# Altium project Chronos.PrjPcb (part 3 of 3)

## Sheet 08- Bank2_6_7.SchDoc: Bank 2-6-7
size A3; Page Number: 6; Page Size: B; Page Count: 14; Board Rev: B; Project Name: CrossLink-NX Evaluation Board; RevCode: 1.0; Doc: 305-PD-19-0819; DsnPath: C:\Users\HAltinkilit\Downloads\Crosslink-NX-Design-Files\CrossLink-NX-Eval-Brd-Schematic-RevB-191122.DSN; SchematicName: SCHEMATIC1; PageName: 06 - Serdes SMAs And Switches; PageSize: B; TopSchematic: True
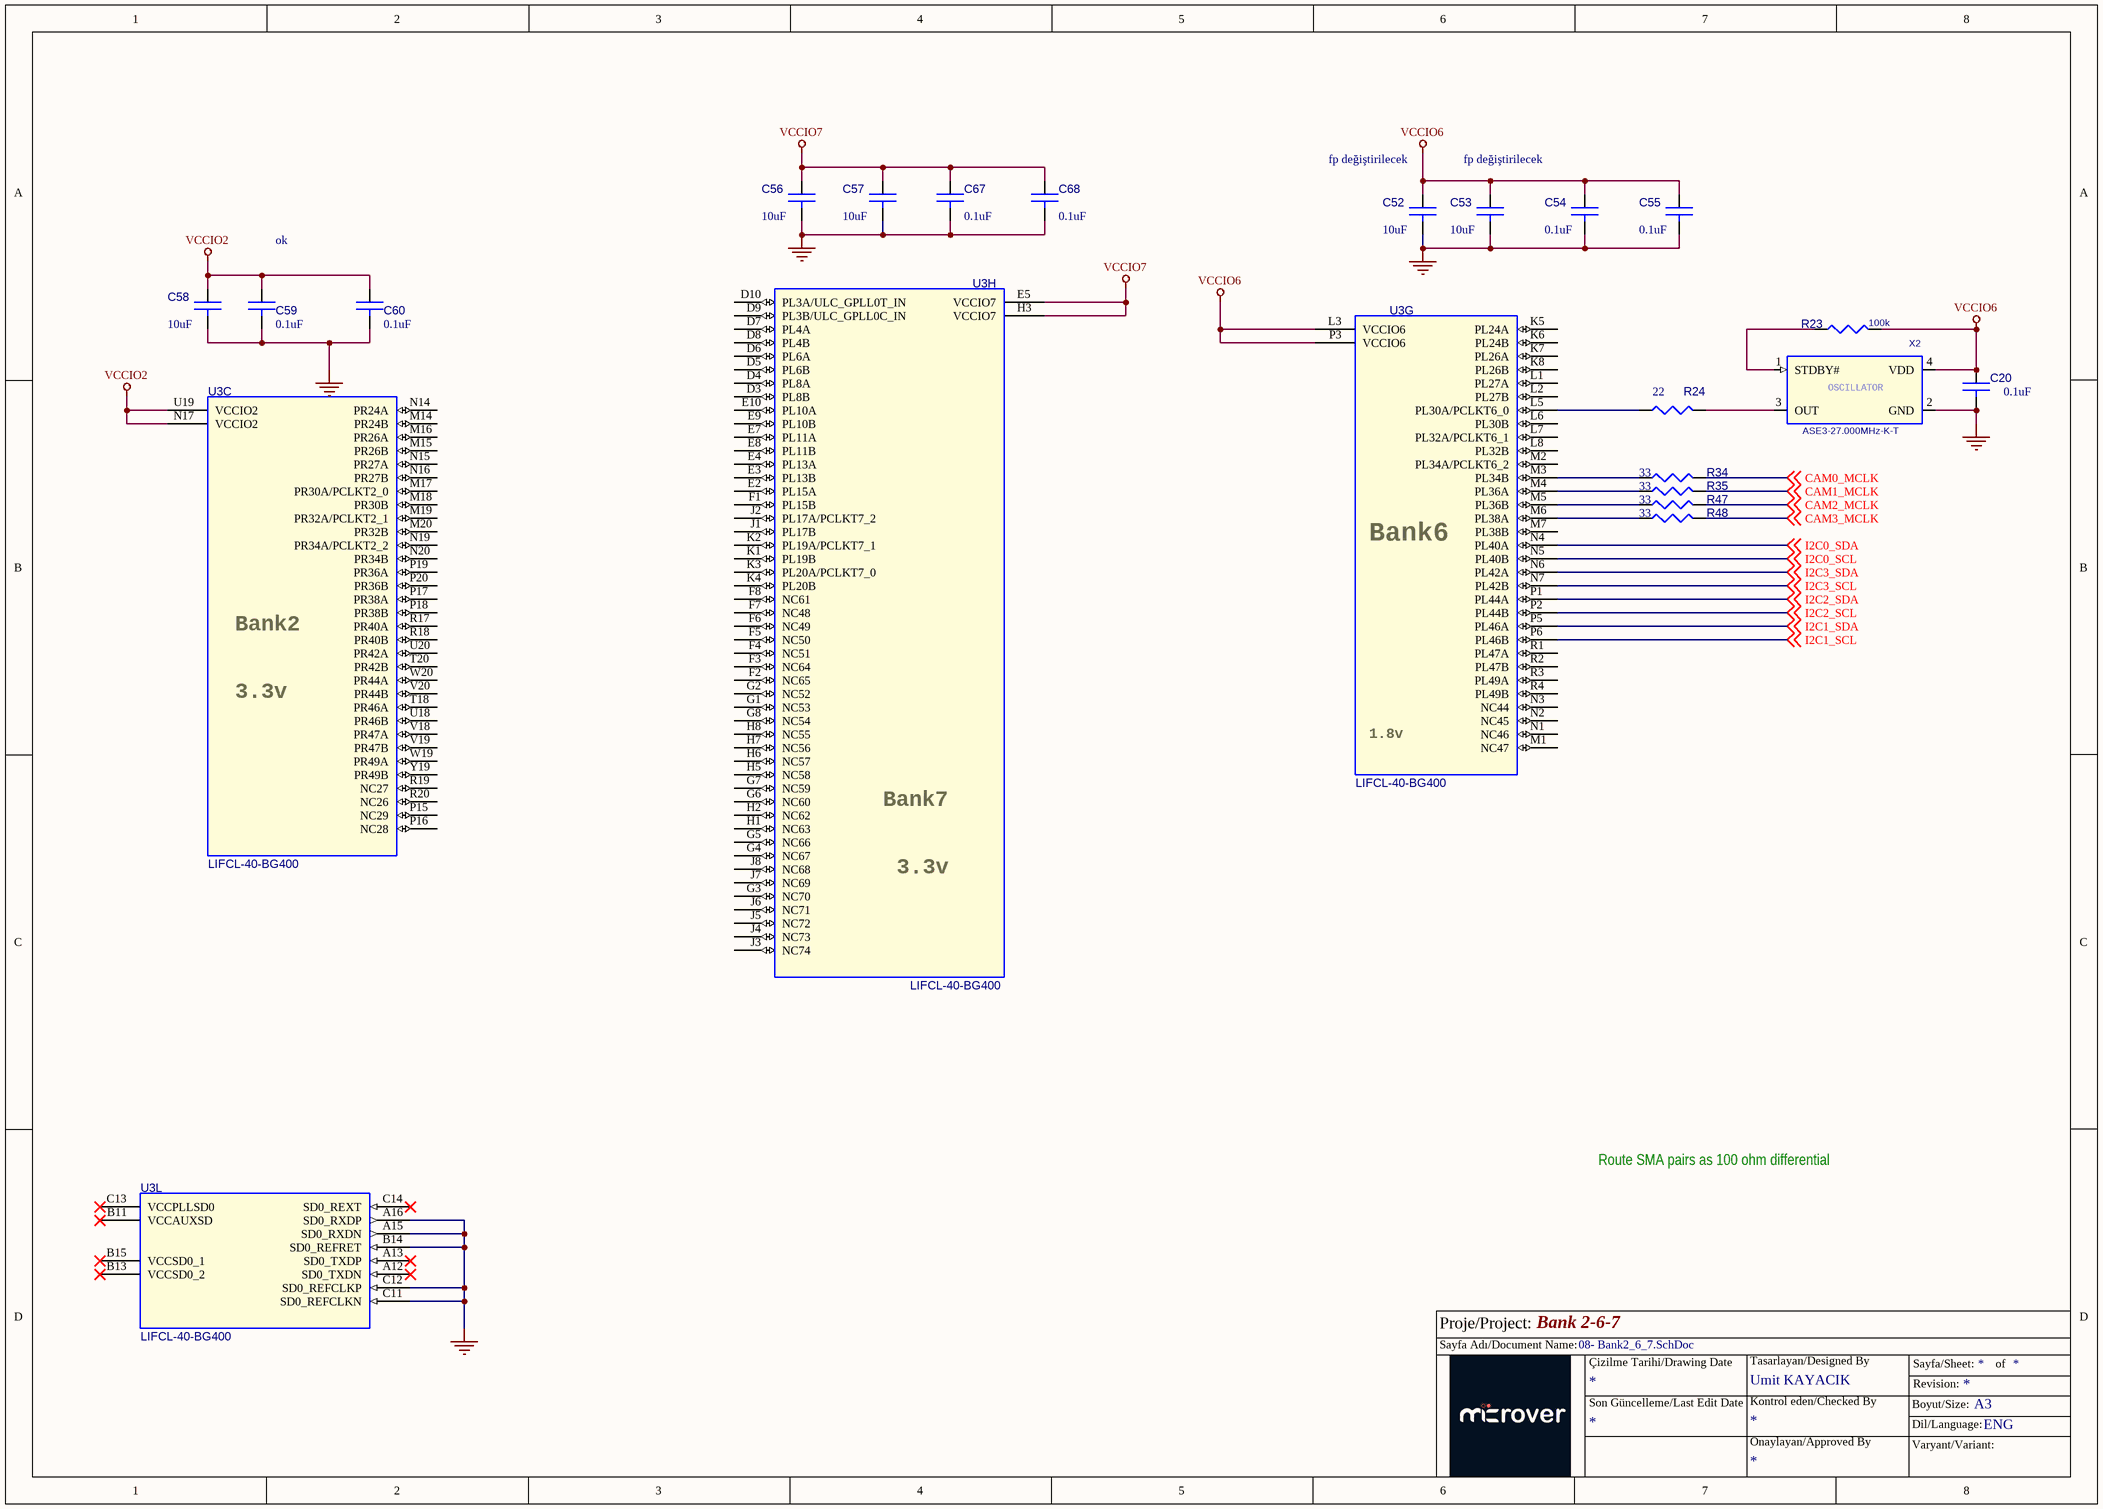
[diagram p7: 08- Bank2_6_7.SchDoc]

### Parts
C20  0.1uF  [C0201]
C52  10uF  [C0603]
C53  10uF  [C0603]
C54  0.1uF  [C0201]
C55  0.1uF  [C0201]
C56  10uF  [C0603]
C57  10uF  [C0603]
C58  10uF  [C0603]
C59  0.1uF  [C0201]
C60  0.1uF  [C0201]
C67  0.1uF  [C0201]
C68  0.1uF  [C0201]
R23  100k  [R0402]
R24  22  [R0402]
R34  33  [R0201]
R35  33  [R0201]
R47  33  [R0201]
R48  33  [R0201]
U3  LIFCL-40-BG400  [LIFCL-40-BG400]  (parts C,G,H,L of 15)
X2  ASE3-27.000MHz-K-T  [27MHZ]

### Nets
GND: C20.2 C52.2 C53.2 C54.2 C55.2 C56.2 C57.2 C58.2 C59.2 C60.2 C67.2 C68.2 U3.A15(SD0_RXDN) U3.A16(SD0_RXDP) U3.B14(SD0_REFRET) U3.C11(SD0_REFCLKN) U3.C12(SD0_REFCLKP) X2.2(GND)
VCCIO2: C58.1 C59.1 C60.1 U3.N17(VCCIO2) U3.U19(VCCIO2)
VCCIO6: C20.1 C52.1 C53.1 C54.1 C55.1 R23.2 U3.L3(VCCIO6) U3.P3(VCCIO6) X2.4(VDD)
VCCIO7: C56.1 C57.1 C67.1 C68.1 U3.E5(VCCIO7) U3.H3(VCCIO7)
CAM0_MCLK: R34.2 ; off-sheet CAM0_MCLK
CAM1_MCLK: R35.2 ; off-sheet CAM1_MCLK
CAM2_MCLK: R47.2 ; off-sheet CAM2_MCLK
CAM3_MCLK: R48.2 ; off-sheet CAM3_MCLK
I2C0_SCL: U3.N5(PL40B) ; off-sheet I2C0_SCL  [project net CAM0_SCL]
I2C0_SDA: U3.N4(PL40A) ; off-sheet I2C0_SDA  [project net CAM0_SDA]
I2C1_SCL: U3.P6(PL46B) ; off-sheet I2C1_SCL  [project net CAM1_SCL]
I2C1_SDA: U3.P5(PL46A) ; off-sheet I2C1_SDA  [project net CAM1_SDA]
I2C2_SCL: U3.P2(PL44B) ; off-sheet I2C2_SCL  [project net CAM2_SCL]
I2C2_SDA: U3.P1(PL44A) ; off-sheet I2C2_SDA  [project net CAM2_SDA]
I2C3_SCL: U3.N7(PL42B) ; off-sheet I2C3_SCL  [project net CAM3_SCL]
I2C3_SDA: U3.N6(PL42A) ; off-sheet I2C3_SDA  [project net CAM3_SDA]
NetR23_1: R23.1 X2.1(STDBY#)
NetR24_1: R24.1 X2.3(OUT)
NetR24_2: R24.2 U3.L5(PL30A/PCLKT6_0)
NetR34_1: R34.1 U3.M3(PL34B)
NetR35_1: R35.1 U3.M4(PL36A)
NetR47_1: R47.1 U3.M5(PL36B)
NetR48_1: R48.1 U3.M6(PL38A)

Not connected (* = marked no-connect by the designer): U3 A12(SD0_TXDN)* A13(SD0_TXDP)* B11(VCCAUXSD)* B13(VCCSD0_2)* B15(VCCSD0_1)* C13(VCCPLLSD0)* C14(SD0_REXT)* D3(PL8B) D4(PL8A) D5(PL6B) D6(PL6A) D7(PL4A) D8(PL4B) D9(PL3B/ULC_GPLL0C_IN) D10(PL3A/ULC_GPLL0T_IN) E2(PL15A) E3(PL13B) E4(PL13A) E7(PL11A) E8(PL11B) E9(PL10B) E10(PL10A) F1(PL15B) F2(NC65) F3(NC64) F4(NC51) F5(NC50) F6(NC49) F7(NC48) F8(NC61) G1(NC53) G2(NC52) G3(NC70) G4(NC67) G5(NC66) G6(NC60) G7(NC59) G8(NC54) H1(NC63) H2(NC62) H5(NC58) H6(NC57) H7(NC56) H8(NC55) J1(PL17B) J2(PL17A/PCLKT7_2) J3(NC74) J4(NC73) J5(NC72) J6(NC71) J7(NC69) J8(NC68) K1(PL19B) K2(PL19A/PCLKT7_1) K3(PL20A/PCLKT7_0) K4(PL20B) K5(PL24A) K6(PL24B) K7(PL26A) K8(PL26B) L1(PL27A) L2(PL27B) L6(PL30B) L7(PL32A/PCLKT6_1) L8(PL32B) M1(NC47) M2(PL34A/PCLKT6_2) M7(PL38B) M14(PR24B) M15(PR26B) M16(PR26A) M17(PR30A/PCLKT2_0) M18(PR30B) M19(PR32A/PCLKT2_1) M20(PR32B) N1(NC46) N2(NC45) N3(NC44) N14(PR24A) N15(PR27A) N16(PR27B) N19(PR34A/PCLKT2_2) N20(PR34B) P15(NC29) P16(NC28) P17(PR38A) P18(PR38B) P19(PR36A) P20(PR36B) R1(PL47A) R2(PL47B) R3(PL49A) R4(PL49B) R17(PR40A) R18(PR40B) R19(NC27) R20(NC26) T18(PR46A) T20(PR42B) U18(PR46B) U20(PR42A) V18(PR47A) V19(PR47B) V20(PR44B) W19(PR49A) W20(PR44A) Y19(PR49B)

### Notes on the sheet
- (near C52) fp değiştirilecek
- fp değiştirilecek
- ok
- (near X2) OSCILLATOR
- (near U3) Bank6
- (near U3) Bank2
- (near U3) 3.3v
- (near U3) 1.8v
- (near U3) Bank7
- Route SMA pairs as 100 ohm differential
- Proje/Project:
- Sayfa Adı/Document Name:
- Çizilme Tarihi/Drawing Date
- Umit KAYACIK
- Tasarlayan/Designed By
- Sayfa/Sheet:
- Revision:
- of
- Son Güncelleme/Last Edit Date
- Kontrol eden/Checked By
- Onaylayan/Approved By
- Boyut/Size:
- Varyant/Variant:
- Dil/Language:
- A3
- ENG

### Library data of the parts
C20 = 0u1_0402: CAP CER 0.1UF 25V 10% X5R 0201; Manufacturer: Murata; Manufacturer Part Number: GRM033R61E104KE14J; Part Reference: C20; Class: Discrete; Digikey P/N: 399-3521-2-ND; Assy: -; Value: 0.1uF; PCB Footprint: C0201
C52 = 10uF_0603: CAP CECAP CER 10UF 10V X5R 20% 0603; Manufacturer: Taiyo Yuden; Manufacturer Part Number: LMK107BJ106MALTD; Part Reference: C39; Class: Discrete; Digikey P/N: 587-2562-1-ND; Assy: -; Value: 10uF; PCB Footprint: C0603
C53 = 0u1_0402: CAP CECAP CER 10UF 10V X5R 20% 0603; Manufacturer: Taiyo Yuden; Manufacturer Part Number: LMK107BJ106MALTD; Part Reference: C40; Class: Discrete; Digikey P/N: 399-3521-2-ND; Assy: -; Value: 10uF; PCB Footprint: C0603
C54 = 0u1_0402: CAP CER 0.1UF 25V 10% X5R 0201; Manufacturer: Murata; Manufacturer Part Number: GRM033R61E104KE14J; Part Reference: C41; Class: Discrete; Digikey P/N: 399-3521-2-ND; Assy: -; Value: 0.1uF; PCB Footprint: C0201
C55 = 0u1_0402: CAP CER 0.1UF 25V 10% X5R 0201; Manufacturer: Murata; Manufacturer Part Number: GRM033R61E104KE14J; Part Reference: C42; Class: Discrete; Digikey P/N: 399-3521-2-ND; Assy: -; Value: 0.1uF; PCB Footprint: C0201
C56 = 10uF_0603: CAP CECAP CER 10UF 10V X5R 20% 0603; Manufacturer: Taiyo Yuden; Manufacturer Part Number: LMK107BJ106MALTD; Part Reference: C68; Class: Discrete; Digikey P/N: 587-2562-1-ND; Assy: -; Value: 10uF; PCB Footprint: C0603
C57 = 10uF_0603: CAP CECAP CER 10UF 10V X5R 20% 0603; Manufacturer: Taiyo Yuden; Manufacturer Part Number: LMK107BJ106MALTD; Part Reference: C69; Class: Discrete; Digikey P/N: 587-2562-1-ND; Assy: -; Value: 10uF; PCB Footprint: C0603
C58 = 10uF_0603: CAP CECAP CER 10UF 10V X5R 20% 0603; Manufacturer: Taiyo Yuden; Manufacturer Part Number: LMK107BJ106MALTD; Part Reference: C58; Class: Discrete; Digikey P/N: 587-2562-1-ND; Assy: -; Value: 10uF; PCB Footprint: C0603
C59 = 0u1_0402: CAP CER 0.1UF 25V 10% X5R 0201; Manufacturer: Murata; Manufacturer Part Number: GRM033R61E104KE14J; Part Reference: C59; Class: Discrete; Digikey P/N: 399-3521-2-ND; Assy: -; Value: 0.1uF; PCB Footprint: C0201
C60 = 0u1_0402: CAP CER 0.1UF 25V 10% X5R 0201; Manufacturer: Murata; Manufacturer Part Number: GRM033R61E104KE14J; Part Reference: C60; Class: Discrete; Digikey P/N: 399-3521-2-ND; Assy: -; Value: 0.1uF; PCB Footprint: C0201
C67 = 0u1_0402: CAP CER 0.1UF 25V 10% X5R 0201; Manufacturer: Murata; Manufacturer Part Number: GRM033R61E104KE14J; Part Reference: C70; Class: Discrete; Digikey P/N: 399-3521-2-ND; Assy: -; Value: 0.1uF; PCB Footprint: C0201
C68 = 0u1_0402: CAP CER 0.1UF 25V 10% X5R 0201; Manufacturer: Murata; Manufacturer Part Number: GRM033R61E104KE14J; Part Reference: C71; Class: Discrete; Digikey P/N: 399-3521-2-ND; Assy: -; Value: 0.1uF; PCB Footprint: C0201
R23 = RES_100K_1W16_0402_5P: RES 100K OHM 1/10W 1% 0402 SMD; Part Reference: R23; Unit Price (USD): 0.02; Total Area(sq-mm): 0.5; Wattage: 1/16W; DIST: FLAT; MAX_TEMP: RTMAX; MFG P/N: ERJ-2RKF1003X; MFG: Panasonic; TC1: 0; Length(mm): 1; Width(mm): 0.5; TC2: 0; Value: 100k; Manufacturer Part Number: ERJ-2RKF1003X; Manufacturer: Panasonic; PART_NUMBER: ERJ-2RKF1003X; Assy: -; PCB Footprint: R0402
R24 = 0R_0603: RES SMD 22 OHM 1% 1/10W 0402; Manufacturer: Panasonic; Manufacturer Part Number: ERJ-2RKF22R0X; Part Reference: R24; Class: Discrete; Digikey P/N: 311-0.0GRTR-ND; Assy: -; Value: 22; MFG P/N: ERJ-2RKF22R0X; MFG: Panasonic; PCB Footprint: R0402
R34 R35 R47 R48 = 0R_0603: RES SMD 33 OHM 1% 1/10W; Manufacturer: Panasonic; Manufacturer Part Number: ERJ-2RKF33R0X; Part Reference: R5; Class: Discrete; PCB Footprint: R0402; Digikey P/N: 311-0.0GRTR-ND; Assy: -; Value: 33
U3 = LIFCL-40-BG400: Part Reference: U3; Source Part: LIFCL-40-BG400A.Normal; SWAP_INFO: (S1+S2+S3+S4+S5+S6+S7+S8+S9+S10+S11+S12+S13+S14+S15); SPLIT_INST: TRUE; Name: I17266603; Primitive: DEFAULT; Implementation Type: <none>; Location X-Coordinate: 0; Source Library: C:\USERS\SLIU1\DOCUMENTS\PCB_DESIGN\JEDI_EVAL_BOARD\SCHEMATIC\LIFCL40.OLB; Power Pins Visible: False; Value: LIFCL-40-BG400; Assy: -; Location Y-Coordinate: 0; Color: Default; Source Package: LIFCL-40-BG400; Graphic: LIFCL-40-BG400A.Normal; PCB Footprint: LIFCL-40-BG400
X2 = OSC_25MHz_10PPM: Standard Clock Oscillators 27.000M 1.8V 30ppm; Part Reference: X2; Manufacturer: ABRACON; MFG: Abracon Corporation; Total Area(sq-mm): 16.83; MFG P/N: ASFLMB-25.000MHZ-LY-T; Unit Price (USD): 1.96; Length(mm: 5.1; Width(mm): 3.3; Value: ASE3-27.000MHz-K-T; Assy: -; Manufacturer Part Number: ASE3-27.000MHz-K-T; PCB Footprint: 27MHZ

## Sheet 09- I2C, LEDs And Push Button.SchDoc: I2C LEDs And Push Buttons
size A3; Page Number: 7; Page Size: B; Page Count: 14; Board Rev: B; Project Name: CrossLink-NX Evaluation Board; RevCode: 1.0; Doc: 305-PD-19-0819; DsnPath: C:\Users\HAltinkilit\Downloads\Crosslink-NX-Design-Files\CrossLink-NX-Eval-Brd-Schematic-RevB-191122.DSN; SchematicName: SCHEMATIC1; PageName: 07 - I2C, LEDs And Push Button; PageSize: B; TopSchematic: True
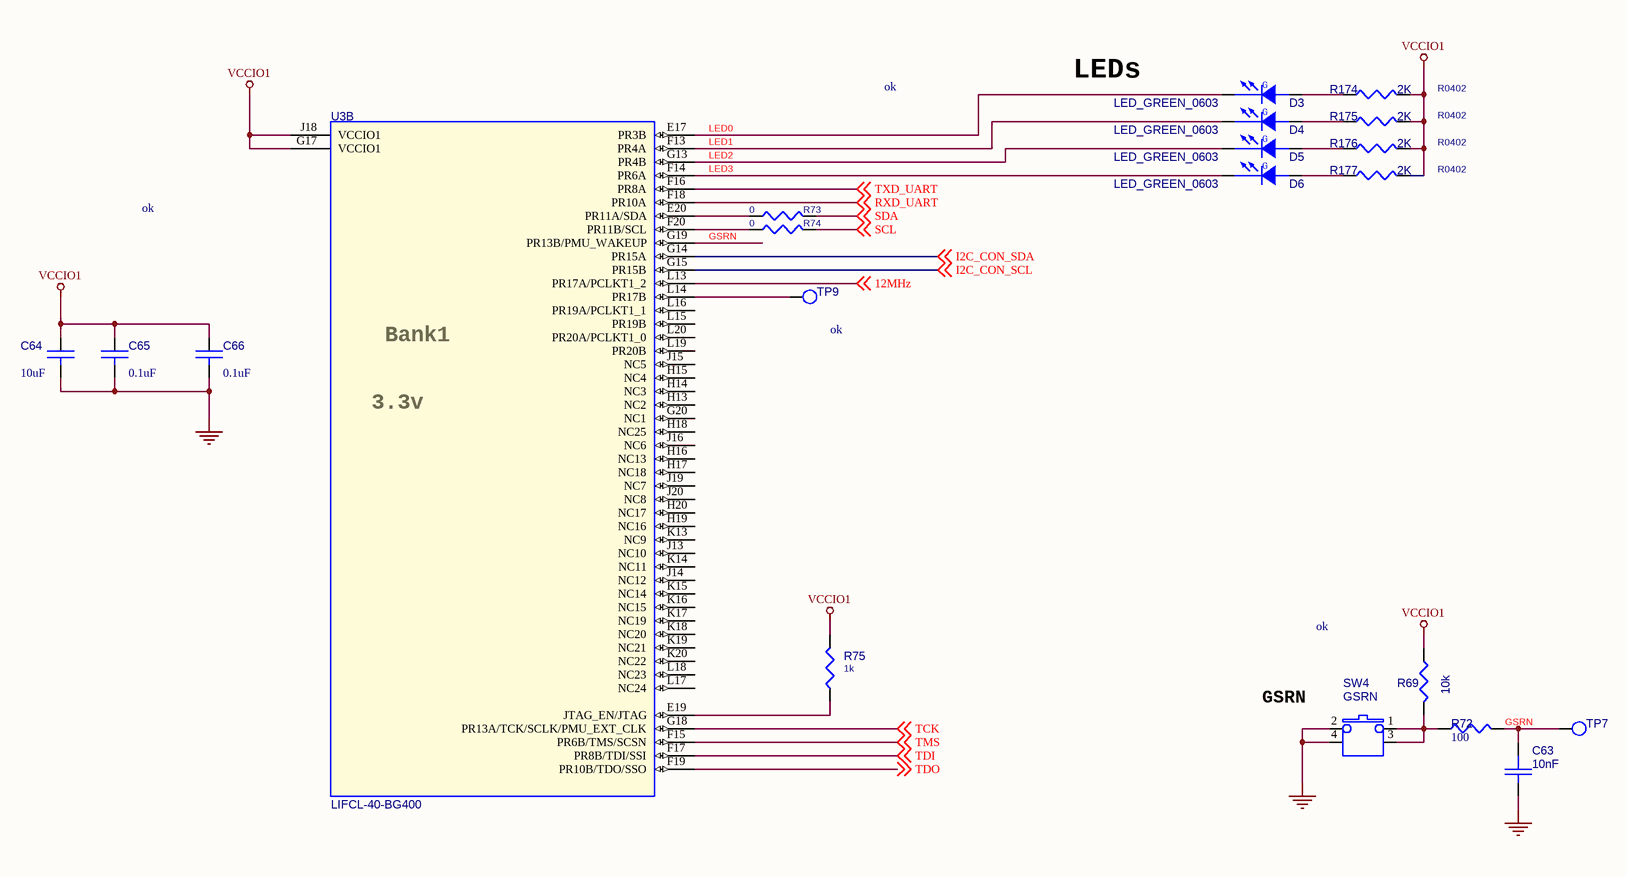
[diagram p8: 09- I2C, LEDs And Push Button.SchDoc]

### Parts
C63  10nF  [RLP-130-A]
C64  10uF  [C0603]
C65  0.1uF  [C0201]
C66  0.1uF  [C0201]
D3  LED_GREEN_0603  [APT1608]
D4  LED_GREEN_0603  [APT1608]
D5  LED_GREEN_0603  [APT1608]
D6  LED_GREEN_0603  [APT1608]
R69  10k  [R0402]
R72  100  [R0402]
R73  0  [R0402]
R74  0  [R0402]
R75  1k  [R0402]
R174  2K  [R0402]
R175  2K  [R0402]
R176  2K  [R0402]
R177  2K  [R0402]
SW4  GSRN  [4psmd_switch]
TP7  TestPoint  [TP_1MM]  (value not drawn)
TP9  TestPoint  [TP_1MM]  (value not drawn)
U3  LIFCL-40-BG400  [LIFCL-40-BG400]  (part B of 15)

### Nets
GND: C63.2 C64.2 C65.2 C66.2 SW4.2 SW4.4
VCCIO1: C64.1 C65.1 C66.1 R69.1 R75.2 R174.2 R175.2 R176.2 R177.2 U3.G17(VCCIO1) U3.J18(VCCIO1)
12MHz: U3.L13(PR17A/PCLKT1_2) ; off-sheet 12MHz
GSRN: C63.1 R72.2 TP7.1(TP) U3.G19(PR13B/PMU_WAKEUP)
I2C_CON_SCL: U3.G15(PR15B) ; off-sheet I2C_CON_SCL
I2C_CON_SDA: U3.G14(PR15A) ; off-sheet I2C_CON_SDA
LED0: D3.1(CATHODE) U3.E17(PR3B)
LED1: D4.1(CATHODE) U3.F13(PR4A)
LED2: D5.1(CATHODE) U3.G13(PR4B)
LED3: D6.1(CATHODE) U3.F14(PR6A)
RXD_UART: U3.F18(PR10A) ; off-sheet RXD_UART
SCL: R74.1 ; off-sheet SCL
SDA: R73.1 ; off-sheet SDA
TCK: U3.G18(PR13A/TCK/SCLK/PMU_EXT_CLK) ; off-sheet TCK
TDI: U3.F17(PR8B/TDI/SSI) ; off-sheet TDI
TDO: U3.F19(PR10B/TDO/SSO) ; off-sheet TDO
TMS: U3.F15(PR6B/TMS/SCSN) ; off-sheet TMS
TXD_UART: U3.F16(PR8A) ; off-sheet TXD_UART
NetD3_2: D3.2(ANODE) R174.1
NetD4_2: D4.2(ANODE) R175.1
NetD5_2: D5.2(ANODE) R176.1
NetD6_2: D6.2(ANODE) R177.1
NetR69_2: R69.2 R72.1 SW4.1 SW4.3
NetR73_2: R73.2 U3.E20(PR11A/SDA)
NetR74_2: R74.2 U3.F20(PR11B/SCL)
NetR75_1: R75.1 U3.E19(JTAG_EN/JTAG)
NetTP9_1: TP9.1(TP) U3.L14(PR17B)

Not connected (* = marked no-connect by the designer): U3 G20(NC1) H13(NC2) H14(NC3) H15(NC4) H16(NC13) H17(NC18) H18(NC25) H19(NC16) H20(NC17) J13(NC10) J14(NC12) J15(NC5) J16(NC6) J19(NC7) J20(NC8) K13(NC9) K14(NC11) K15(NC14) K16(NC15) K17(NC19) K18(NC20) K19(NC21) K20(NC22) L15(PR19B) L16(PR19A/PCLKT1_1) L17(NC24) L18(NC23) L19(PR20B) L20(PR20A/PCLKT1_0)

### Notes on the sheet
- LEDs
- ok
- (near U3) Bank1
- (near TP9) ok
- (near U3) 3.3v
- (near SW4) GSRN
- Proje/Project:
- Sayfa Adı/Document Name:
- Çizilme Tarihi/Drawing Date
- Umit KAYACIK
- Tasarlayan/Designed By
- Sayfa/Sheet:
- Revision:
- of
- Son Güncelleme/Last Edit Date
- Kontrol eden/Checked By
- Onaylayan/Approved By
- Boyut/Size:
- Varyant/Variant:
- Dil/Language:
- A3
- ENG
- (in symbol LED-SMT1206_GREEN_1) G

### Library data of the parts
C63 = CAP_1: Part Reference: C63; Value: 10nF; Assy: -; PCB Footprint: RLP-130-A
C64 = 10uF_0603: CAP CECAP CER 10UF 10V X5R 20% 0603; Manufacturer: Taiyo Yuden; Manufacturer Part Number: LMK107BJ106MALTD; Part Reference: C64; Class: Discrete; Digikey P/N: 587-2562-1-ND; Assy: -; Value: 10uF; PCB Footprint: C0603
C65 = 0u1_0402: CAP CER 0.1UF 25V 10% X5R 0201; Manufacturer: Murata; Manufacturer Part Number: GRM033R61E104KE14J; Part Reference: C65; Class: Discrete; Digikey P/N: 399-3521-2-ND; Assy: -; Value: 0.1uF; PCB Footprint: C0201
C66 = 0u1_0402: CAP CER 0.1UF 25V 10% X5R 0201; Manufacturer: Murata; Manufacturer Part Number: GRM033R61E104KE14J; Part Reference: C66; Class: Discrete; Digikey P/N: 399-3521-2-ND; Assy: -; Value: 0.1uF; PCB Footprint: C0201
D3 = LED-SMT1206_GREEN_1: Part Reference: D3; Value: LED_GREEN_0603; Assy: -; PCB Footprint: APT1608
D4 = LED-SMT1206_GREEN_1: Part Reference: D4; Value: LED_GREEN_0603; Assy: -; PCB Footprint: APT1608
D5 = LED-SMT1206_GREEN_1: Part Reference: D5; Value: LED_GREEN_0603; Assy: -; PCB Footprint: APT1608
D6 = LED-SMT1206_GREEN_1: Part Reference: D6; Value: LED_GREEN_0603; Assy: -; PCB Footprint: APT1608
R69 = RES_0: RES SMD 10K OHM 1% 1/16W 0402; Part Reference: R69; Manufacturer: Yageo; MFG P/N: RC0402FR-0710KL; Value: 10k; MFG: Yageo; Manufacturer Part Number: RC0402FR-0710KL; Assy: -; PCB Footprint: R0402
R72 = 0R_0603: RES SMD 100 OHM 1% 1/16W 0402; Manufacturer: Yageo; Manufacturer Part Number: RC0402FR-07100RL; Part Reference: R72; Class: Discrete; Digikey P/N: 311-0.0GRTR-ND; Assy: -; Value: 100; MFG: Yageo; PCB Footprint: R0402
R73 = R_Dup3: RES SMD 33 OHM 1% 1/10W 0402; Part Reference: R73; Manufacturer: Panasonic; Manufacturer Part Number: ERJ-2RKF33R0X; Value: 0; Assy: -; PCB Footprint: R0402
R74 = R_Dup3: RES SMD 33 OHM 1% 1/10W 0402; Part Reference: R74; Manufacturer: Panasonic; Manufacturer Part Number: ERJ-2RKF33R0X; Value: 0; Assy: -; PCB Footprint: R0402
R75 = RES_100K_1W16_0402_5P: RES 100K OHM 1/10W 1% 0402 SMD; Part Reference: R75; Unit Price (USD): 0.02; Total Area(sq-mm): 0.5; Wattage: 1/16W; DIST: FLAT; MAX_TEMP: RTMAX; MFG P/N: ERJ-2RKF1003X; MFG: Panasonic; TC1: 0; Length(mm): 1; Width(mm): 0.5; TC2: 0; Value: 1k; Assy: -; Manufacturer Part Number: ERJ-2RKF1003X; Manufacturer: Panasonic; PART_NUMBER: ERJ-2RKF1003X; PCB Footprint: R0402
R174 = RES_0: RES SMD 2K OHM 5% 1/10W 0402; Part Reference: R174; Manufacturer Part Number: ERJ-2GEJ202X; MFG: Panasonic; Value: 2K; Manufacturer: Panasonic; MFG P/N: ERJ-2GEJ202X; Assy: -; PCB Footprint: R0402
R175 = RES_0: RES SMD 2K OHM 5% 1/10W 0402; Part Reference: R175; Manufacturer Part Number: ERJ-2GEJ202X; MFG: Panasonic; Value: 2K; Manufacturer: Panasonic; MFG P/N: ERJ-2GEJ202X; Assy: -; PCB Footprint: R0402
R176 = RES_0: RES SMD 2K OHM 5% 1/10W 0402; Part Reference: R176; Manufacturer Part Number: ERJ-2GEJ202X; MFG: Panasonic; Value: 2K; Manufacturer: Panasonic; MFG P/N: ERJ-2GEJ202X; Assy: -; PCB Footprint: R0402
R177 = RES_0: RES SMD 2K OHM 5% 1/10W 0402; Part Reference: R177; Manufacturer Part Number: ERJ-2GEJ202X; MFG: Panasonic; Value: 2K; Manufacturer: Panasonic; MFG P/N: ERJ-2GEJ202X; Assy: -; PCB Footprint: R0402
SW4 = SW PUSHBUTTON-SPST/SM: SWITCH TACTILE SPST-NO 0.05A 12V; Part Reference: SW4; Manufacturer Part Number: 434153017835; MFG: Wurth; Value: GSRN; Assy: -; Man. Part #: 434153017835; Manufacturer: Wurth; MFG P/N: 434153017835; PCB Footprint: 4psmd_switch
TP7 = T POINT R: Part Reference: TP7; PCB Footprint: TP50; Value: TestPoint; Assy: -
TP9 = T POINT R: Part Reference: TP9; PCB Footprint: TP50; Value: TestPoint; Assy: -
U3 = LIFCL-40-BG400: as U3 on sheet 08- Bank2_6_7; Value: LIFCL-40-BG400; Assy: -; Location Y-Coordinate: 0; Color: Default; Source Package: LIFCL-40-BG400; Graphic: LIFCL-40-BG400A.Normal; PCB Footprint: LIFCL-40-BG400

## Sheet 10 - Configuration And ADC.SchDoc: Configuration and ADC
size A3; Page Number: 10; Page Size: B; Page Count: 12; Board Rev: B; Project Name: CrossLink-NX Evaluation Board; RevCode: 1.0; Doc: 305-PD-19-0819; DsnPath: C:\Users\HAltinkilit\Downloads\Crosslink-NX-Design-Files\CrossLink-NX-Eval-Brd-Schematic-RevB-191122.DSN; SchematicName: SCHEMATIC1; PageName: 09 - Configuration And ADC; PageSize: B; TopSchematic: True
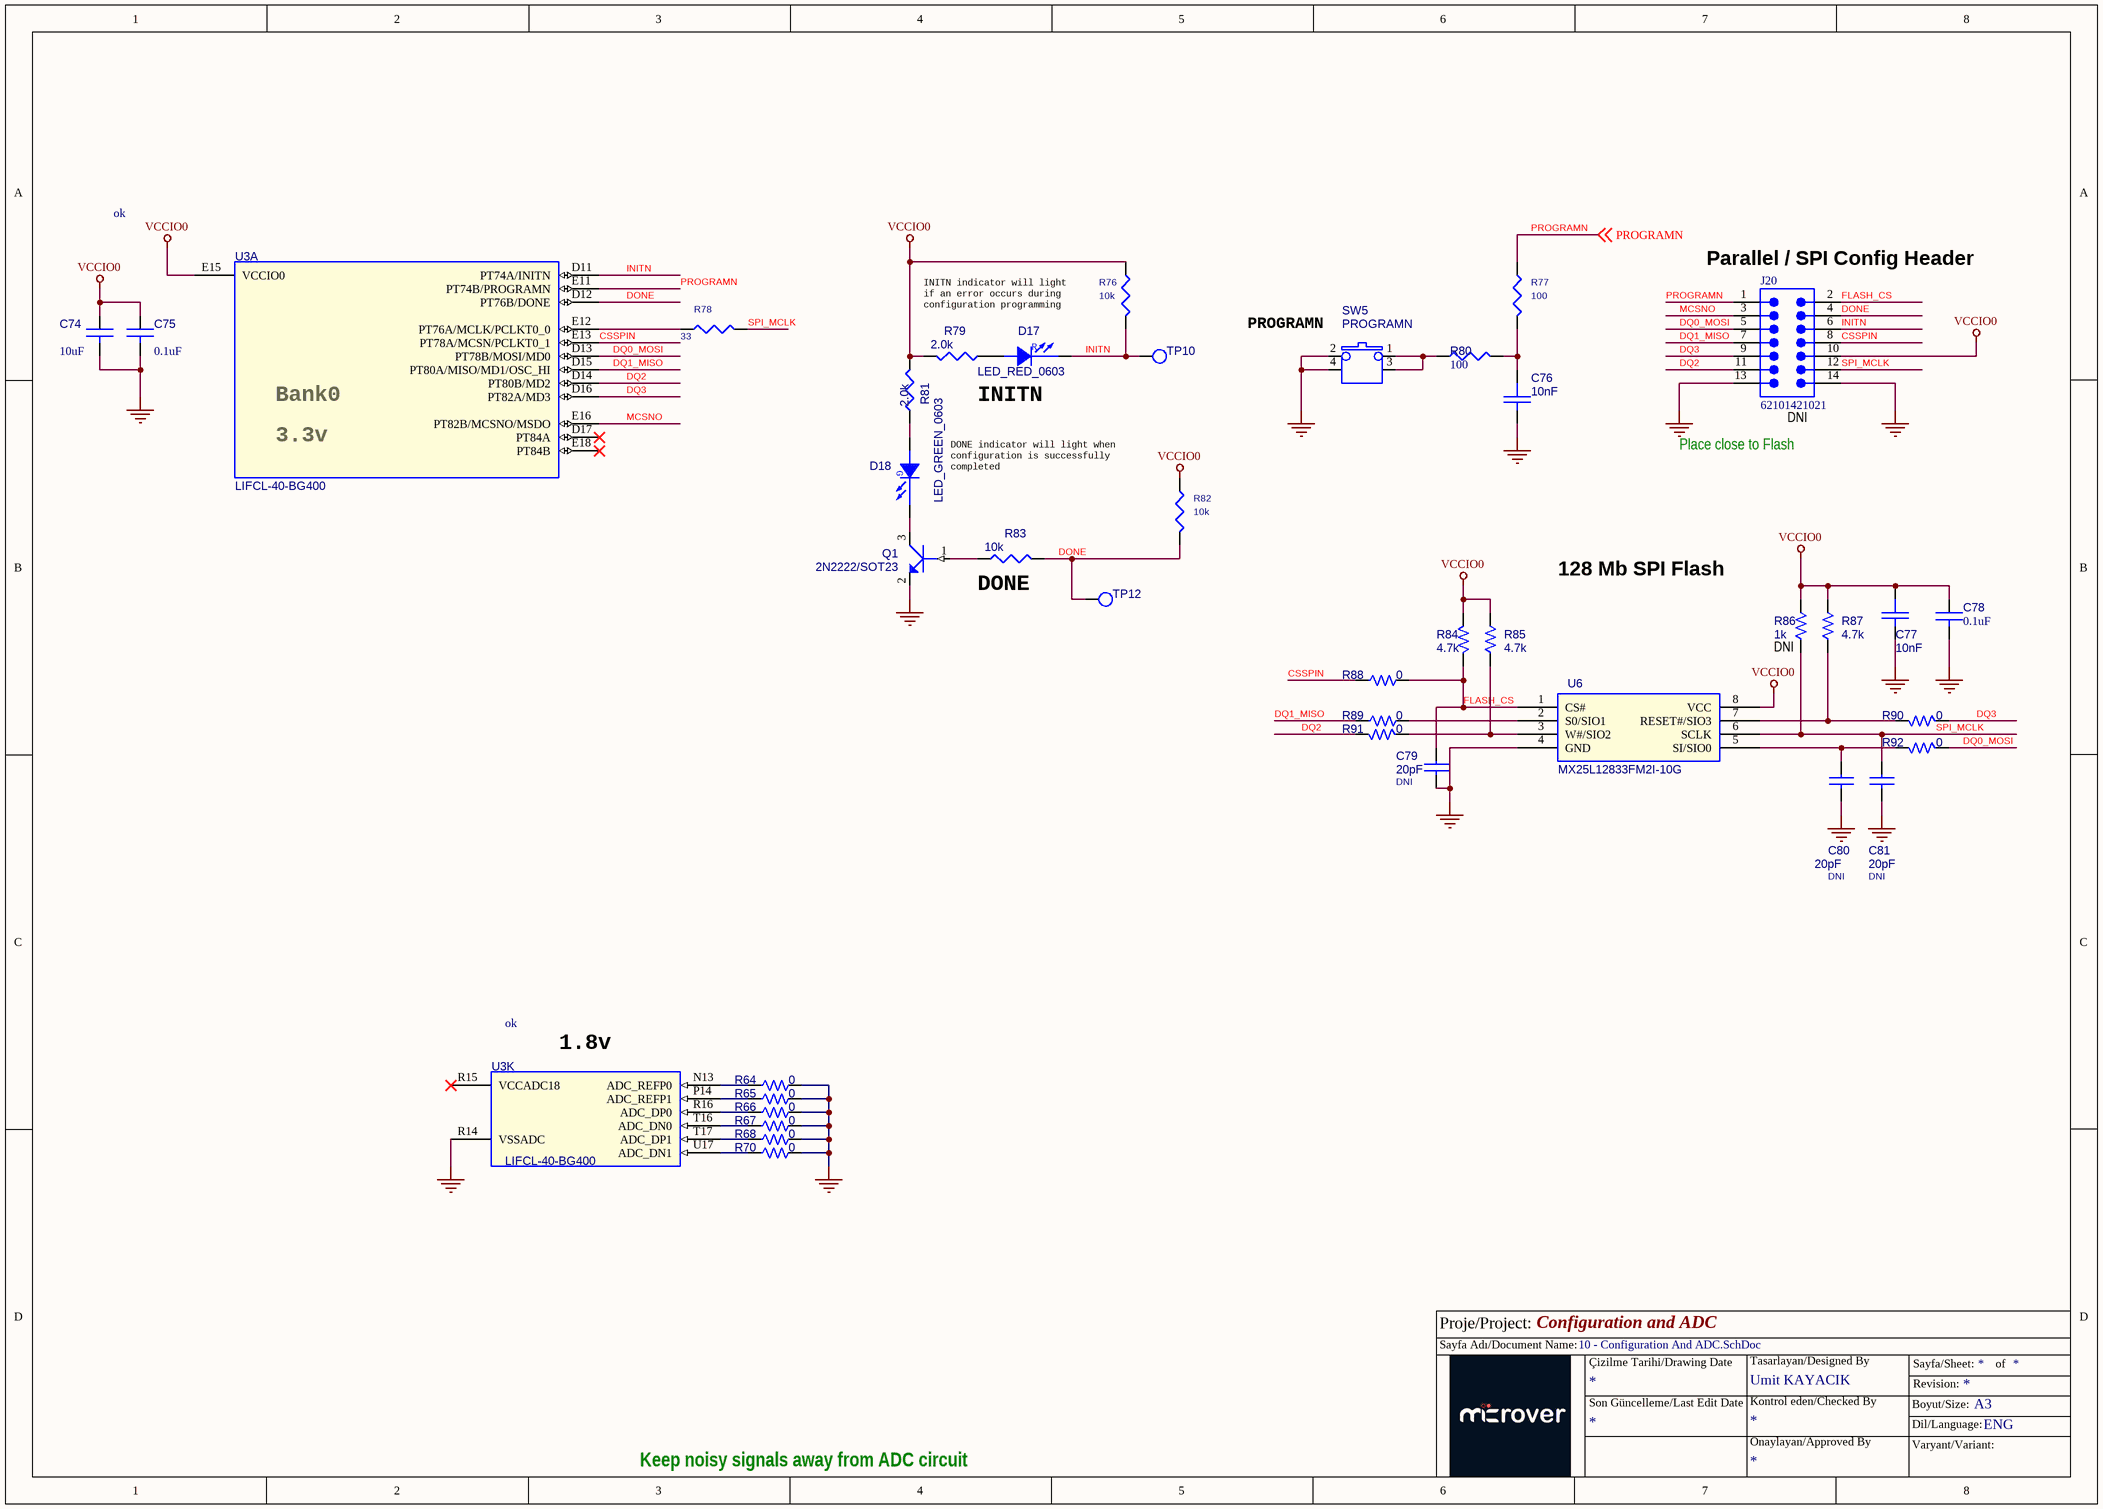
[diagram p9: 10 - Configuration And ADC.SchDoc]

### Parts
C74  10uF  [C0603]
C75  0.1uF  [C0201]
C76  10nF  [RLP-130-A]
C77  10nF  [RLP-130-A]
C78  0.1uF  [C0402]
C79  20pF  populate: DNI  [C0402]
C80  20pF  populate: DNI  [C0402]
C81  20pF  populate: DNI  [c0402]
D17  LED_RED_0603  [APT1608]
D18  LED_GREEN_0603  [APT1608]
J20  62101421021  [62101421021]
Q1  2N2222/SOT23  [MMBT2222ALT-1]
R64  0  [R0201]
R65  0  [R0201]
R66  0  [R0201]
R67  0  [R0201]
R68  0  [R0201]
R70  0  [R0201]
R76  10k  [R0402]
R77  100  [R0402]
R78  33  [R0402]
R79  2.0k  [R0402]
R80  100  [R0402]
R81  2.0k  [R0402]
R82  10k  [R0402]
R83  10k  [R0402]
R84  4.7k  [R0402]
R85  4.7k  [R0402]
R86  1k  [R0402]
R87  4.7k  [R0402]
R88  0  [R0402]
R89  0  [R0402]
R90  0  [R0402]
R91  0  [R0402]
R92  0  [R0402]
SW5  PROGRAMN  [4psmd_switch]
TP10  TestPoint  [TP_1MM]  (value not drawn)
TP12  TestPoint  [TP_1MM]  (value not drawn)
U3  LIFCL-40-BG400  [LIFCL-40-BG400]  (parts A,K of 15)
U6  MX25L12833FM2I-10G  [SO8_MX25L12833FM2I10G]

### Nets
GND: C74.2 C75.2 C76.2 C77.2 C78.2 C79.2 C80.2 C81.2 J20.13 J20.14 Q1.2(EMITTER) R64.2 R65.2 R66.2 R67.2 R68.2 R70.2 SW5.2 SW5.4 U3.R14(VSSADC) U6.4(GND)
VCCIO0: C74.1 C75.1 C77.1 C78.1 J20.10 R76.1 R79.2 R81.2 R82.1 R84.2 R85.2 R86.2 R87.2 U3.E15(VCCIO0) U6.8(VCC)
CSSPIN: J20.8 R88.1 U3.E13(PT78A/MCSN/PCLKT0_1)
DONE: J20.4 R82.2 R83.2 TP12.1(TP) U3.D12(PT76B/DONE)
DQ0_MOSI: J20.5 R92.1 U3.D13(PT78B/MOSI/MD0)
DQ1_MISO: J20.7 R89.1 U3.D15(PT80A/MISO/MD1/OSC_HI)
DQ2: J20.11 R91.2 U3.D14(PT80B/MD2)
DQ3: J20.9 R90.1 U3.D16(PT82A/MD3)
FLASH_CS: C79.1 J20.2 R84.1 R88.2 U6.1(CS#)
INITN: D17.1(CATHODE) J20.6 R76.2 TP10.1(TP) U3.D11(PT74A/INITN)
MCSNO: J20.3 U3.E16(PT82B/MCSNO/MSDO)
PROGRAMN: J20.1 R77.1 U3.E11(PT74B/PROGRAMN) ; off-sheet PROGRAMN
SPI_MCLK: C81.1 J20.12 R78.1 R86.1 U6.6(SCLK)
NetC76_1: C76.1 R77.2 R80.2
NetC80_1: C80.1 R92.2 U6.5(SI/SIO0)
NetD17_2: D17.2(ANODE) R79.1
NetD18_1: D18.1(CATHODE) Q1.3(COLLECTOR)
NetD18_2: D18.2(ANODE) R81.1
NetQ1_1: Q1.1(BASE) R83.1
NetR64_1: R64.1 U3.N13(ADC_REFP0)
NetR65_1: R65.1 U3.P14(ADC_REFP1)
NetR66_1: R66.1 U3.R16(ADC_DP0)
NetR67_1: R67.1 U3.T16(ADC_DN0)
NetR68_1: R68.1 U3.T17(ADC_DP1)
NetR70_1: R70.1 U3.U17(ADC_DN1)
NetR78_2: R78.2 U3.E12(PT76A/MCLK/PCLKT0_0)
NetR80_1: R80.1 SW5.1 SW5.3
NetR85_1: R85.1 R91.1 U6.3(W#/SIO2)
NetR87_1: R87.1 R90.2 U6.7(RESET#/SIO3)
NetR89_2: R89.2 U6.2(S0/SIO1)

Not connected (* = marked no-connect by the designer): U3 D17(PT84A)* E18(PT84B)* R15(VCCADC18)*

### Notes on the sheet
- ok
- (near R76) INITN indicator will light
  if an error occurs during
  configuration programming
- (near J20) Parallel / SPI Config Header
- (near SW5) PROGRAMN
- (near U3) 3.3v
- (near U3) Bank0
- INITN
- Place close to Flash
- (near J20) DNI
- DONE indicator will light when
  configuration is successfully
  completed
- 128 Mb SPI Flash
- (near R83) DONE
- (near R86) DNI
- (near U3) 1.8v
- Keep noisy signals away from ADC circuit
- Proje/Project:
- Sayfa Adı/Document Name:
- Çizilme Tarihi/Drawing Date
- Umit KAYACIK
- Tasarlayan/Designed By
- Sayfa/Sheet:
- Revision:
- of
- Son Güncelleme/Last Edit Date
- Kontrol eden/Checked By
- Onaylayan/Approved By
- Boyut/Size:
- Varyant/Variant:
- Dil/Language:
- A3
- ENG
- (in symbol LED-SMT1206_GREEN_1) G
- (in symbol LED-SMT1206_RED_0) R

### Library data of the parts
C74 = 10uF_0603: CAP CECAP CER 10UF 10V X5R 20% 0603; Manufacturer: Taiyo Yuden; Manufacturer Part Number: LMK107BJ106MALTD; Part Reference: C74; Class: Discrete; Digikey P/N: 587-2562-1-ND; Assy: -; Value: 10uF; PCB Footprint: C0603
C75 = 0u1_0402: CAP CER 0.1UF 25V 10% X5R 0201; Manufacturer: Murata; Manufacturer Part Number: GRM033R61E104KE14J; Part Reference: C75; Class: Discrete; Digikey P/N: 399-3521-2-ND; Assy: -; Value: 0.1uF; PCB Footprint: C0201
C76 = CAP_1: Part Reference: C76; Value: 10nF; Assy: -; PCB Footprint: RLP-130-A
C77 = CAP_1: Part Reference: C77; Value: 10nF; PCB Footprint: RLP-130-A; Assy: -
C78 = 0u1_0402: CAP CER 0.1UF 25V 10% X5R 0402; Manufacturer: Murata; Manufacturer Part Number: GRM033R61E104KE14J; Part Reference: C78; Class: Discrete; PCB Footprint: C0201; Digikey P/N: 399-3521-2-ND; Assy: -; Value: 0.1uF
C79 = CAP NP_Dup1: Part Reference: C79; Assy: DNI; COMPHEIGHT: 0.000; MEMORY: NO; COMPGROUP: 0; COMPROT: 270; COMPLOC: [1820.000,2015.000]; COMPSIDE: TOP; FPLIST: SM/C_0402; PCB Footprint: RLP-132; Value: 20pF; DECOUPLER: NO; COMPKEY: NO; COMPLOCKED: NO; COMPFIXED: NO
C80 = CAP NP_Dup1: Part Reference: C80; COMPHEIGHT: 0.000; MEMORY: NO; COMPGROUP: 0; COMPROT: 270; COMPLOC: [1820.000,2015.000]; COMPSIDE: TOP; FPLIST: SM/C_0402; Assy: DNI; PCB Footprint: RLP-132; Value: 20pF; DECOUPLER: NO; COMPKEY: NO; COMPLOCKED: NO; COMPFIXED: NO
C81 = CAP NP_Dup1: Part Reference: C81; Assy: DNI; COMPHEIGHT: 0.000; MEMORY: NO; COMPGROUP: 0; COMPROT: 270; COMPLOC: [1820.000,2015.000]; COMPSIDE: TOP; FPLIST: SM/C_0402; PCB Footprint: RLP-132; Value: 20pF; DECOUPLER: NO; COMPKEY: NO; COMPLOCKED: NO; COMPFIXED: NO
D17 = LED-SMT1206_RED_0: Part Reference: D17; Value: LED_RED_0603; Assy: -; PCB Footprint: APT1608
D18 = LED-SMT1206_GREEN_1: Part Reference: D18; Value: LED_GREEN_0603; Assy: -; PCB Footprint: APT1608
J20 = CMP-1502-00928-4: Conn, Header, 14Pos, 2Row, 1.27Mm Rohs Compliant: Yes; Contact Resistance: 20mΩ; Gender: Male; Current Rating: 1A; Operating Supply Voltage: 100V; Orientation: Vertical; RoHS: Non-Compliant; Lead Pitch: 1.27mm; Number of Pins: 14
Q1 = 2N2222: Part Reference: Q1; Value: 2N2222/SOT23; Assy: -; PCB Footprint: MMBT2222ALT-1
R64-R68 R70 = R_Dup2: RES SMD 0.0OHM JUMPER 1/10W 0402; Part Reference: R88; Manufacturer Part Number: ERJ-2GE0R00X; Manufacturer: Panasonic; DIST: FLAT; PSpiceTemplate: R^@REFDES %1 %2 ?TOLERANCE|R^@REFDES| @VALUE  ?TOLERANCE|\n.model R^@REFDES RES R=1 DEV=@TOLERANCE%|; VOLTAGE: RVMAX; SLOPE: RSMAX; MAX_TEMP: RTMAX; POWER: RMAX; FPLIST: AX/RC05; COMPSIDE: TOP; COMPLOC: [3325.000,1400.000]; COMPROT: 180; COMPFIXED: NO; COMPHEIGHT: 0.000; PCB Footprint: R0402; Value: 0; Assy: -; COMPGROUP: 0; COMPLOCKED: NO; COMPKEY: NO; DECOUPLER: NO; MEMORY: NO
R76 = R_Dup3: RES SMD 10K OHM 1% 1/16W 0402; Part Reference: R76; Manufacturer Part Number: RC0402FR-0710KL; MFG: Yageo; Value: 10k; Assy: -; Manufacturer: Yageo; MFG P/N: RC0402FR-0710KL; PCB Footprint: R0402
R77 = R_Dup3: RES SMD 100 OHM 1% 1/16W 0402; Part Reference: R77; Manufacturer Part Number: RC0402FR-07100RL; MFG: Yageo; Value: 100; Assy: -; Manufacturer: Yageo; MFG P/N: RC0402FR-07100RL; PCB Footprint: R0402
R78 = R_Dup3: RES SMD 33 OHM 1% 1/10W 0402; Part Reference: R78; Manufacturer Part Number: ERJ-2RKF33R0X; Manufacturer: Panasonic; Value: 33; Assy: -; PCB Footprint: R0402
R79 = RES_0: RES SMD 1K OHM 1% 1/10W 0402; Part Reference: R79; Manufacturer Part Number: ERJ-2RKF1001X; Manufacturer: Panasonic; Value: 2.0k; Assy: -; PCB Footprint: R0402
R80 = 0R_0603: RES SMD 100 OHM 1% 1/16W 0402; Manufacturer: Yageo; Manufacturer Part Number: RC0402FR-07100RL; Part Reference: R80; Class: Discrete; Digikey P/N: 311-0.0GRTR-ND; Assy: -; Value: 100; MFG: Yageo; MFG P/N: RC0402FR-07100RL; PCB Footprint: R0402
R81 = RES_0: RES SMD 1K OHM 1% 1/10W 0402; Part Reference: R81; Manufacturer: Panasonic; Manufacturer Part Number: ERJ-2RKF1001X; Value: 2.0k; Assy: -; PCB Footprint: R0402
R82 = R_Dup3: RES SMD 10K OHM 1% 1/16W 0402; Part Reference: R82; Manufacturer Part Number: RC0402FR-0710KL; MFG: Yageo; Value: 10k; Assy: -; Manufacturer: Yageo; MFG P/N: RC0402FR-0710KL; PCB Footprint: R0402
R83 = RES_0: RES SMD 10K OHM 1% 1/16W 0402; Part Reference: R83; Manufacturer: Yageo; MFG P/N: RC0402FR-0710KL; Value: 10k; Assy: -; MFG: Yageo; Manufacturer Part Number: RC0402FR-0710KL; PCB Footprint: R0402
R84 = R_Dup2: RES SMD 4.7K OHM 5% 1/10W 0402; Part Reference: R84; Manufacturer: Panasonic; DIST: FLAT; PSpiceTemplate: R^@REFDES %1 %2 ?TOLERANCE|R^@REFDES| @VALUE  ?TOLERANCE|\n.model R^@REFDES RES R=1 DEV=@TOLERANCE%|; VOLTAGE: RVMAX; SLOPE: RSMAX; MAX_TEMP: RTMAX; POWER: RMAX; MFG P/N: ERJ-2GEJ472X; COMPHEIGHT: 0.000; MEMORY: NO; COMPGROUP: 0; COMPROT: 180; COMPLOC: [970.000,1160.000]; COMPSIDE: TOP; FPLIST: AX/RC05,SM/R_0603; Value: 4.7k; Assy: -; MFG: Panasonic; Manufacturer Part Number: ERJ-2GEJ472X; DECOUPLER: NO; COMPKEY: NO; COMPLOCKED: NO; COMPFIXED: NO; PCB Footprint: R0402
R85 = R_Dup2: RES SMD 4.7K OHM 5% 1/10W 0402; Part Reference: R85; Manufacturer: Panasonic; DIST: FLAT; PSpiceTemplate: R^@REFDES %1 %2 ?TOLERANCE|R^@REFDES| @VALUE  ?TOLERANCE|\n.model R^@REFDES RES R=1 DEV=@TOLERANCE%|; VOLTAGE: RVMAX; SLOPE: RSMAX; MAX_TEMP: RTMAX; POWER: RMAX; MFG P/N: ERJ-2GEJ472X; COMPHEIGHT: 0.000; MEMORY: NO; COMPGROUP: 0; COMPROT: 180; COMPLOC: [970.000,1160.000]; COMPSIDE: TOP; FPLIST: AX/RC05,SM/R_0603; Value: 4.7k; Assy: -; MFG: Panasonic; Manufacturer Part Number: ERJ-2GEJ472X; DECOUPLER: NO; COMPKEY: NO; COMPLOCKED: NO; COMPFIXED: NO; PCB Footprint: R0402
R86 = R_Dup2: RES SMD 1K OHM 1% 1/10W 0402; Part Reference: R86; Manufacturer Part Number: ERJ-2RKF1001X; Manufacturer: Panasonic; DIST: FLAT; PSpiceTemplate: R^@REFDES %1 %2 ?TOLERANCE|R^@REFDES| @VALUE  ?TOLERANCE|\n.model R^@REFDES RES R=1 DEV=@TOLERANCE%|; VOLTAGE: RVMAX; SLOPE: RSMAX; MAX_TEMP: RTMAX; POWER: RMAX; Assy: DNI; COMPHEIGHT: 0.000; MEMORY: NO; COMPGROUP: 0; COMPROT: 180; COMPLOC: [970.000,1160.000]; COMPSIDE: TOP; FPLIST: AX/RC05,SM/R_0603; Value: 1k; DECOUPLER: NO; COMPKEY: NO; COMPLOCKED: NO; COMPFIXED: NO; PCB Footprint: R0402
R87 = R_Dup2: RES SMD 4.7K OHM 5% 1/10W 0402; Part Reference: R87; Manufacturer: Panasonic; DIST: FLAT; PSpiceTemplate: R^@REFDES %1 %2 ?TOLERANCE|R^@REFDES| @VALUE  ?TOLERANCE|\n.model R^@REFDES RES R=1 DEV=@TOLERANCE%|; VOLTAGE: RVMAX; SLOPE: RSMAX; MAX_TEMP: RTMAX; POWER: RMAX; MFG P/N: ERJ-2GEJ472X; FPLIST: AX/RC05,SM/R_0603; COMPSIDE: TOP; COMPLOC: [970.000,1160.000]; COMPROT: 180; COMPGROUP: 0; COMPFIXED: NO; COMPHEIGHT: 0.000; Value: 4.7k; Assy: -; MFG: Panasonic; Manufacturer Part Number: ERJ-2GEJ472X; COMPLOCKED: NO; COMPKEY: NO; DECOUPLER: NO; MEMORY: NO; PCB Footprint: R0402
R88 = R_Dup2: RES SMD 0.0OHM JUMPER 1/10W 0402; Part Reference: R88; Manufacturer Part Number: ERJ-2GE0R00X; Manufacturer: Panasonic; DIST: FLAT; PSpiceTemplate: R^@REFDES %1 %2 ?TOLERANCE|R^@REFDES| @VALUE  ?TOLERANCE|\n.model R^@REFDES RES R=1 DEV=@TOLERANCE%|; VOLTAGE: RVMAX; SLOPE: RSMAX; MAX_TEMP: RTMAX; POWER: RMAX; FPLIST: AX/RC05; COMPSIDE: TOP; COMPLOC: [3325.000,1400.000]; COMPROT: 180; COMPFIXED: NO; COMPHEIGHT: 0.000; Value: 0; Assy: -; COMPGROUP: 0; COMPLOCKED: NO; COMPKEY: NO; DECOUPLER: NO; MEMORY: NO; PCB Footprint: R0402
R89 = R_Dup2: RES SMD 0.0OHM JUMPER 1/10W 0402; Part Reference: R89; Manufacturer Part Number: ERJ-2GE0R00X; Manufacturer: Panasonic; DIST: FLAT; PSpiceTemplate: R^@REFDES %1 %2 ?TOLERANCE|R^@REFDES| @VALUE  ?TOLERANCE|\n.model R^@REFDES RES R=1 DEV=@TOLERANCE%|; VOLTAGE: RVMAX; SLOPE: RSMAX; MAX_TEMP: RTMAX; POWER: RMAX; FPLIST: AX/RC05; COMPSIDE: TOP; COMPLOC: [3325.000,1400.000]; COMPROT: 180; COMPFIXED: NO; COMPHEIGHT: 0.000; Value: 0; Assy: -; COMPGROUP: 0; COMPLOCKED: NO; COMPKEY: NO; DECOUPLER: NO; MEMORY: NO; PCB Footprint: R0402
R90 = R_Dup2: RES SMD 0.0OHM JUMPER 1/10W 0402; Part Reference: R90; Manufacturer Part Number: ERJ-2GE0R00X; Manufacturer: Panasonic; DIST: FLAT; PSpiceTemplate: R^@REFDES %1 %2 ?TOLERANCE|R^@REFDES| @VALUE  ?TOLERANCE|\n.model R^@REFDES RES R=1 DEV=@TOLERANCE%|; VOLTAGE: RVMAX; SLOPE: RSMAX; MAX_TEMP: RTMAX; POWER: RMAX; COMPHEIGHT: 0.000; MEMORY: NO; COMPROT: 180; COMPLOC: [3325.000,1400.000]; COMPSIDE: TOP; FPLIST: AX/RC05; Value: 0; Assy: -; DECOUPLER: NO; COMPKEY: NO; COMPLOCKED: NO; COMPFIXED: NO; COMPGROUP: 0; PCB Footprint: R0402
R91 = R_Dup2: RES SMD 0.0OHM JUMPER 1/10W 0402; Part Reference: R91; Manufacturer Part Number: ERJ-2GE0R00X; Manufacturer: Panasonic; DIST: FLAT; PSpiceTemplate: R^@REFDES %1 %2 ?TOLERANCE|R^@REFDES| @VALUE  ?TOLERANCE|\n.model R^@REFDES RES R=1 DEV=@TOLERANCE%|; VOLTAGE: RVMAX; SLOPE: RSMAX; MAX_TEMP: RTMAX; POWER: RMAX; COMPHEIGHT: 0.000; MEMORY: NO; COMPROT: 180; COMPLOC: [3325.000,1400.000]; COMPSIDE: TOP; FPLIST: AX/RC05; Value: 0; Assy: -; DECOUPLER: NO; COMPKEY: NO; COMPLOCKED: NO; COMPFIXED: NO; COMPGROUP: 0; PCB Footprint: R0402
R92 = R_Dup2: RES SMD 0.0OHM JUMPER 1/10W 0402; Part Reference: R92; Manufacturer Part Number: ERJ-2GE0R00X; Manufacturer: Panasonic; DIST: FLAT; PSpiceTemplate: R^@REFDES %1 %2 ?TOLERANCE|R^@REFDES| @VALUE  ?TOLERANCE|\n.model R^@REFDES RES R=1 DEV=@TOLERANCE%|; VOLTAGE: RVMAX; SLOPE: RSMAX; MAX_TEMP: RTMAX; POWER: RMAX; FPLIST: AX/RC05; COMPSIDE: TOP; COMPLOC: [3325.000,1400.000]; COMPROT: 180; COMPFIXED: NO; COMPHEIGHT: 0.000; Value: 0; Assy: -; COMPGROUP: 0; COMPLOCKED: NO; COMPKEY: NO; DECOUPLER: NO; MEMORY: NO; PCB Footprint: R0402
SW5 = SW PUSHBUTTON-SPST/SM: SWITCH TACTILE SPST-NO 0.05A 12V; Part Reference: SW5; Manufacturer Part Number: 434153017835; MFG: Wurth; Value: PROGRAMN; Assy: -; Man. Part #: 434153017835; Manufacturer: Wurth; MFG P/N: 434153017835; PCB Footprint: 4psmd_switch
TP10 = T POINT R: Part Reference: TP10; PCB Footprint: TP50; Value: TestPoint; Assy: -
TP12 = T POINT R: Part Reference: TP12; PCB Footprint: TP50; Value: TestPoint; Assy: -
U3 = LIFCL-40-BG400: Part Reference: U3; SWAP_INFO: (S1+S2+S3+S4+S5+S6+S7+S8+S9+S10+S11+S12+S13+S14+S15); SPLIT_INST: TRUE; Value: LIFCL-40-BG400; Assy: -; PCB Footprint: LIFCL-40-BG400
U6 = N25QxxxA13xF8_0: IC FLASH 128MBIT 104MHZ 8SOP; Part Reference: U6; Manufacturer: Macronix; Populate: DI; Value: MX25L12833FM2I-10G; Assy: -; Manufacturer Part Number: MX25L12833FM2I-10G; PCB Footprint: SO8_MX25L12833FM2I10G

## Sheet 11- IMU.SchDoc: IMU
size A3; Page Number: 11; Page Size: B; Page Count: 12; Board Rev: B; Project Name: CrossLink-NX Evaluation Board; RevCode: 1.0; Doc: 305-PD-19-0819; DsnPath: C:\Users\HAltinkilit\Downloads\Crosslink-NX-Design-Files\CrossLink-NX-Eval-Brd-Schematic-RevB-191122.DSN; SchematicName: SCHEMATIC1; PageName: 14 - Power Diagram; PageSize: B; TopSchematic: True
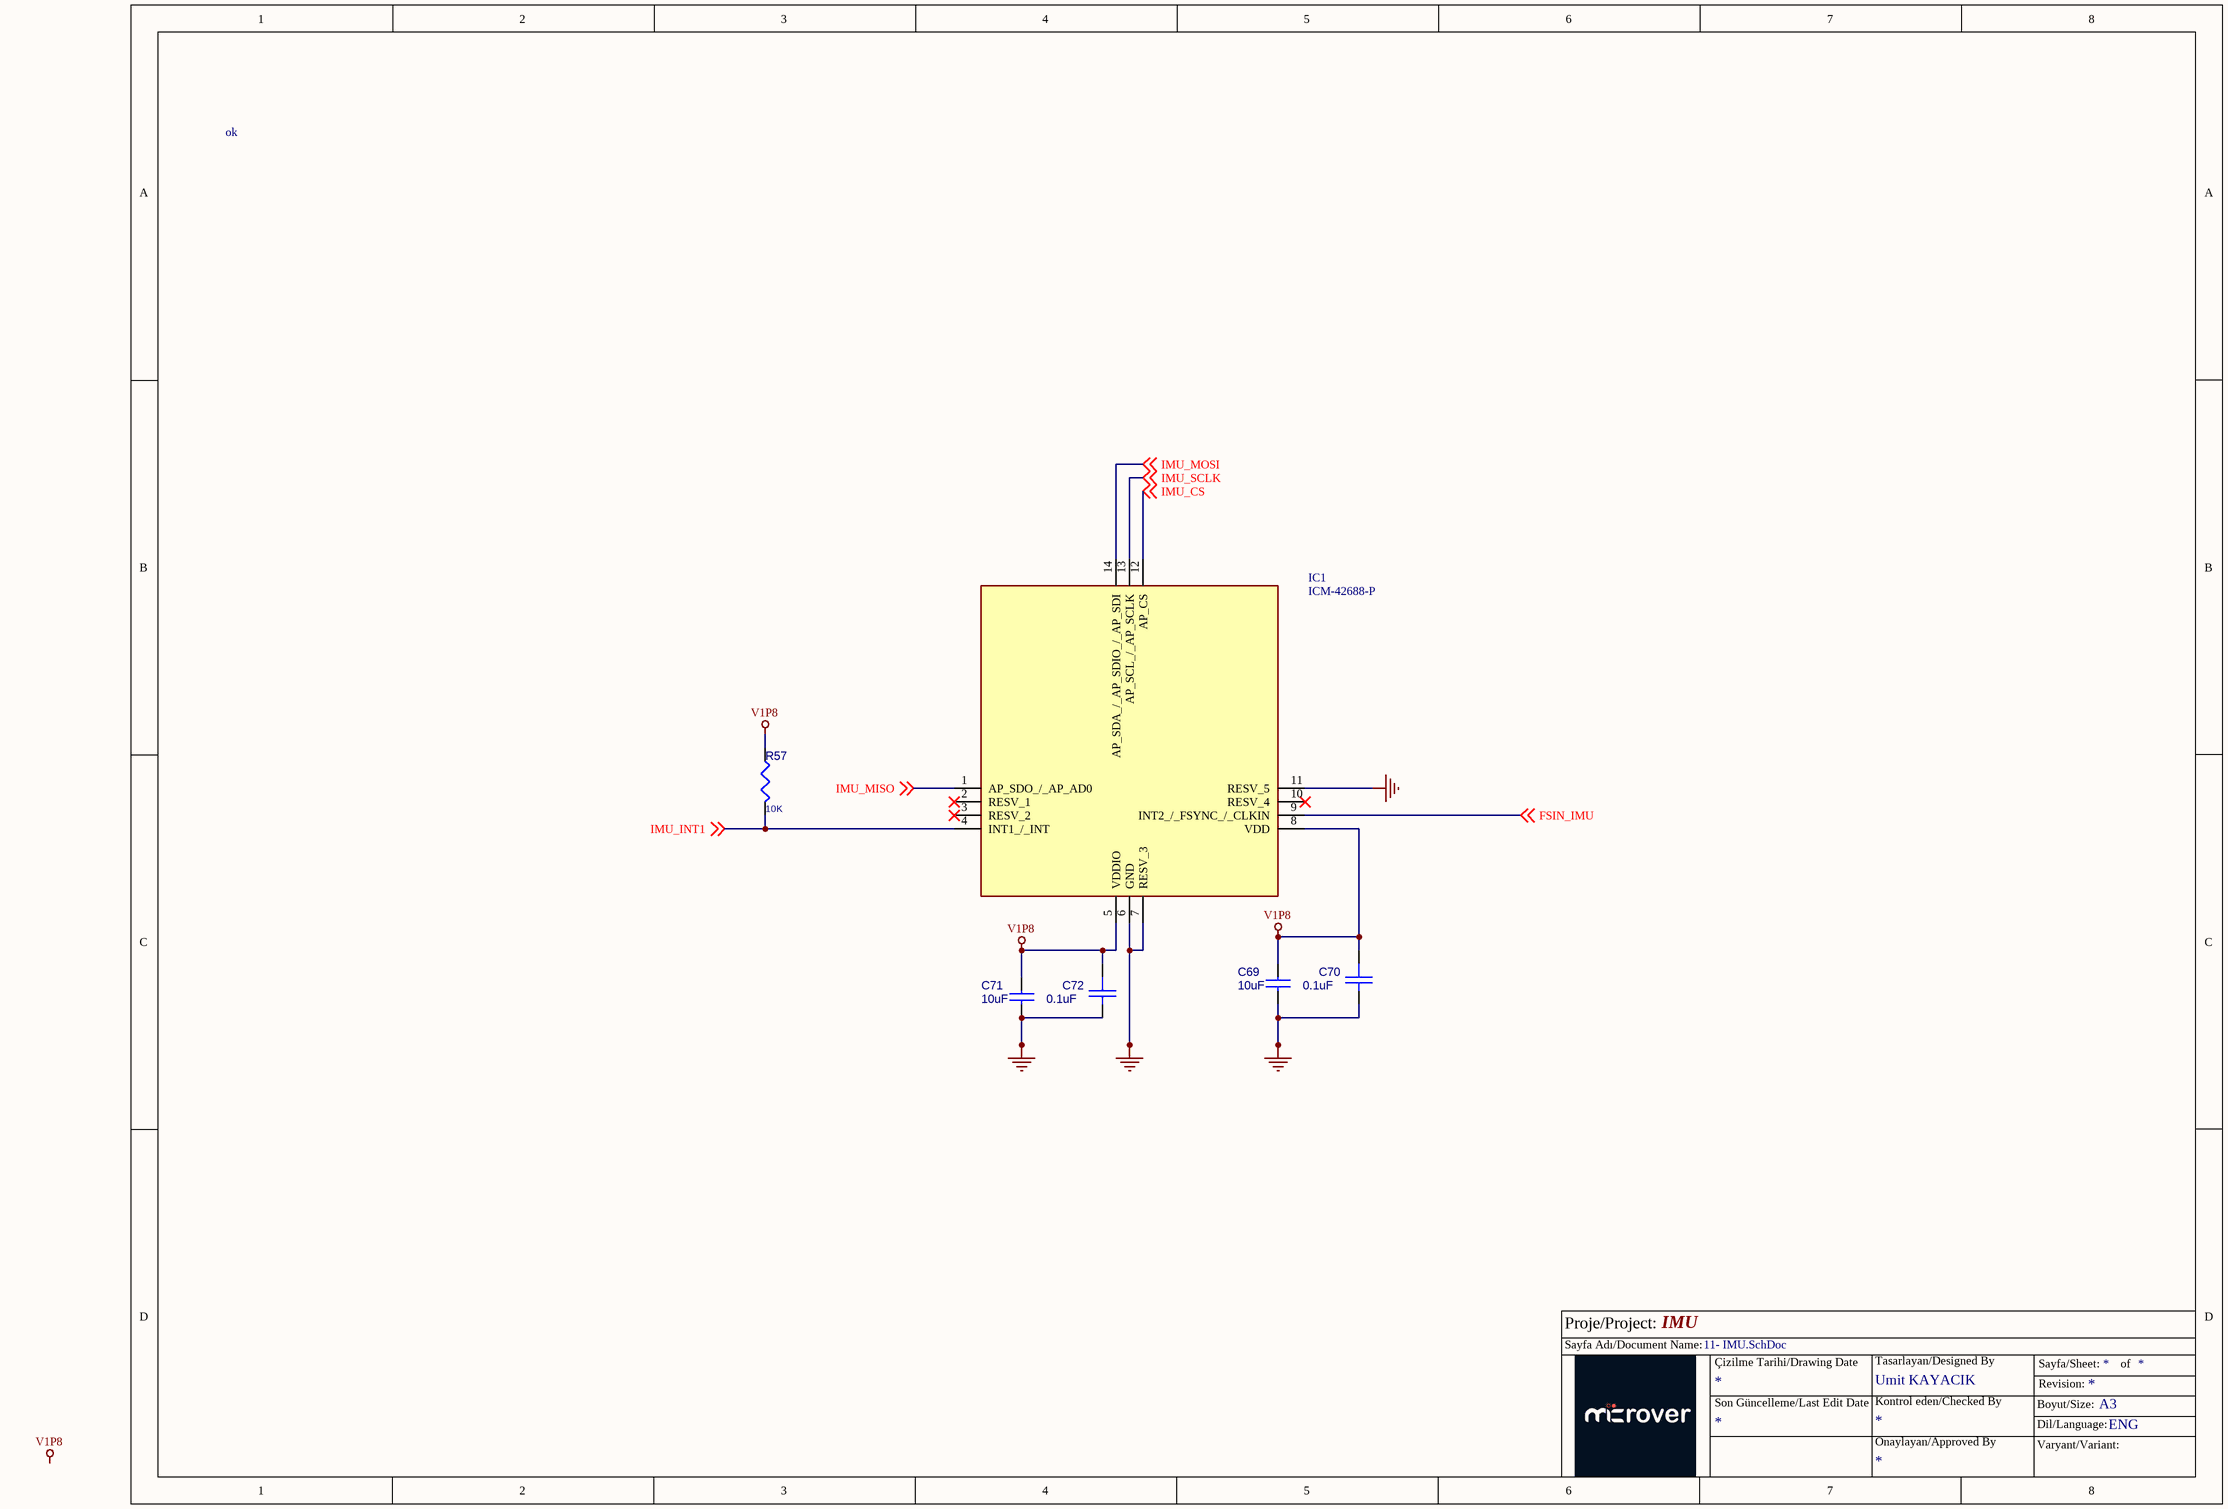
[diagram p10: 11- IMU.SchDoc]

### Parts
C69  10uF  [C0603]
C70  0.1uF  [C0201]
C71  10uF  [C0603]
C72  0.1uF  [C0201]
IC1  ICM-42688-P  [IIM42352]
R57  10K  [R0402]

### Nets
GND: C69.2 C70.2 C71.2 C72.2 IC1.6(GND) IC1.7(RESV_3) IC1.11(RESV_5)
V1P8: C69.1 C70.1 C71.1 C72.1 IC1.5(VDDIO) IC1.8(VDD) R57.1
FSIN_IMU: IC1.9(INT2_/_FSYNC_/_CLKIN) ; off-sheet FSIN_IMU
IMU_CS: IC1.12(AP_CS) ; off-sheet IMU_CS
IMU_INT1: IC1.4(INT1_/_INT) R57.2 ; off-sheet IMU_INT1
IMU_MISO: IC1.1(AP_SDO_/_AP_AD0) ; off-sheet IMU_MISO
IMU_MOSI: IC1.14(AP_SDA_/_AP_SDIO_/_AP_SDI) ; off-sheet IMU_MOSI
IMU_SCLK: IC1.13(AP_SCL_/_AP_SCLK) ; off-sheet IMU_SCLK

Not connected (* = marked no-connect by the designer): IC1 2(RESV_1)* 3(RESV_2)* 10(RESV_4)*

### Notes on the sheet
- ok
- Labels drawn without touching a wire or pin: V1P8
- Proje/Project:
- Sayfa Adı/Document Name:
- Çizilme Tarihi/Drawing Date
- Umit KAYACIK
- Tasarlayan/Designed By
- Sayfa/Sheet:
- Revision:
- of
- Son Güncelleme/Last Edit Date
- Kontrol eden/Checked By
- Onaylayan/Approved By
- Boyut/Size:
- Varyant/Variant:
- Dil/Language:
- A3
- ENG

### Library data of the parts
C69 C71 = CAP NP: CAP CER 10UF 10V 20% X6S 0603; Part Reference: C140; Man. Part #: CL10X106MP8NRNC; MFG: Samsung; Value: 10uF; Assy: -; Manufacturer: Samsung; MFG P/N: CL10X106MP8NRNC; Manufacturer Part Number: CL10X106MP8NRNC; PCB Footprint: C0603
C70 C72 = CAP_SMT_0805: CAP CER 0.1UF 25V 10% X5R 0201; Part Reference: C120; Manufacturer: Murata; Manufacturer Part Number: GRM033R61E104KE14J; Value: 0.1uF; Assy: -; PCB Footprint: C0201
IC1 = ICM-42688-P: Integrated Circuit; Manufacturer_Name: TDK; Datasheet Link: https://3cfeqx1hf82y3xcoull08ihx-wpengine.netdna-ssl.com/wp-content/uploads/2021/06/DS-000347-ICM-42688-P-v1.5.pdf; Manufacturer_Part_Number: ICM-42688-P; Mouser Part Number: 410-ICM-42688-P; Mouser Price/Stock: https://www.mouser.co.uk/ProductDetail/TDK-InvenSense/ICM-42688-P?qs=OlC7AqGiEDk8QrNAV728zw%3D%3D; Arrow Part Number: ICM-42688-P; Arrow Price/Stock: https://www.arrow.com/en/products/icm-42688-p/invensense?utm_currency=USD&region=nac
R57 = RES_10K_1W16_0402_5P: RES 10K OHM 1/10W 5% 0603; Part Reference: R10; Manufacturer Part Number: RMCF0603JT10K0; Unit Price (USD): 0.02; Total Area(sq-mm): 0.5; DIST: FLAT; MAX_TEMP: RTMAX; MFG P/N: RMCF0402JT10K0; MFG: Stackpole Electronics Inc; TC1: 0; PCB Footprint: R0603; Length(mm): 1; Width(mm): 0.5; Wattage: 1/10W; TC2: 0; Value: 10K; Manufacturer: Stackpole Electronics Inc; Digikey P/N: RMCF0603JT10K0TR-ND; Assy: -

## Sheet 12 - JETSON_CON.SchDoc: JETSON-CON
size A3; Page Number: 12; Page Size: B; Page Count: 12; Board Rev: B; RevCode: 1.0; Doc: 305-PD-19-0819; DsnPath: C:\Users\HAltinkilit\Downloads\Crosslink-NX-Design-Files\CrossLink-NX-Eval-Brd-Schematic-RevB-191122.DSN; SchematicName: SCHEMATIC1; PageName: 08 - PMOD; PageSize: B; TopSchematic: True
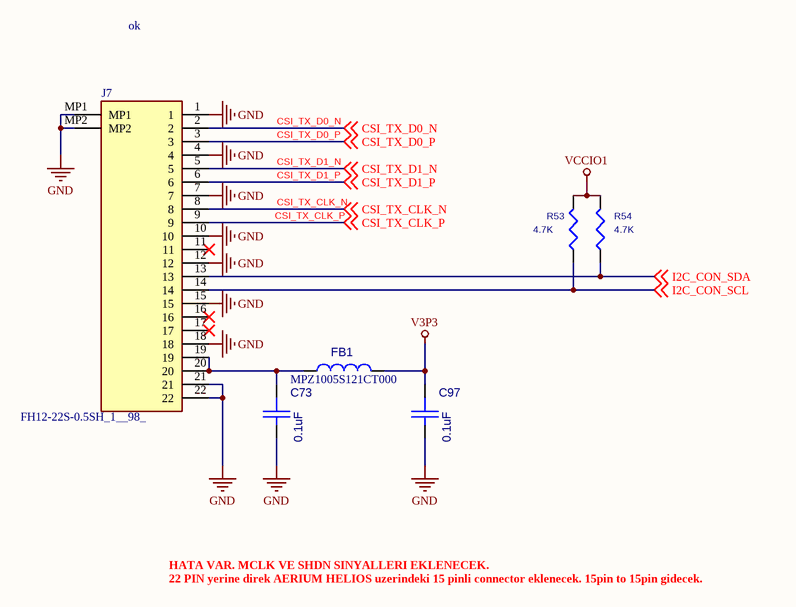
[diagram p11: 12 - JETSON_CON.SchDoc]

### Parts
C73  0.1uF  [C0201]
C97  0.1uF  [C0201]
FB1  MPZ1005S121CT000  [FB0402]
J7  FH12-22S-0.5SH_1__98_  [FH1222S05SH198]
R53  4.7K  [r0402]
R54  4.7K  [r0402]

### Nets
GND: C73.2 C97.2 J7.1 J7.4 J7.7 J7.10 J7.12 J7.15 J7.18 J7.21 J7.22 J7.MP1 J7.MP2
V3P3: C97.1 FB1.1
VCCIO1: R53.2 R54.2
CSI_TX_CLK_N: J7.8 ; off-sheet CSI_TX_CLK_N
CSI_TX_CLK_P: J7.9 ; off-sheet CSI_TX_CLK_P
CSI_TX_D0_N: J7.2 ; off-sheet CSI_TX_D0_N
CSI_TX_D0_P: J7.3 ; off-sheet CSI_TX_D0_P
CSI_TX_D1_N: J7.5 ; off-sheet CSI_TX_D1_N
CSI_TX_D1_P: J7.6 ; off-sheet CSI_TX_D1_P
I2C_CON_SCL: J7.14 R53.1 ; off-sheet I2C_CON_SCL
I2C_CON_SDA: J7.13 R54.1 ; off-sheet I2C_CON_SDA
NetC73_1: C73.1 FB1.2 J7.19 J7.20

Not connected (* = marked no-connect by the designer): J7 11* 16* 17*

### Notes on the sheet
- ok
- HATA VAR. MCLK VE SHDN SINYALLERI EKLENECEK.
- 22 PIN yerine direk AERIUM HELIOS uzerindeki 15 pinli connector eklenecek. 15pin to 15pin gidecek.
- Proje/Project:
- Sayfa Adı/Document Name:
- Çizilme Tarihi/Drawing Date
- Umit KAYACIK
- Tasarlayan/Designed By
- Sayfa/Sheet:
- Revision:
- of
- Son Güncelleme/Last Edit Date
- Kontrol eden/Checked By
- Onaylayan/Approved By
- Boyut/Size:
- Varyant/Variant:
- Dil/Language:
- A3
- ENG

### Library data of the parts
C73 C97 = CAP_1: CAP CER 0.1UF 25V 10% X5R 0201; Part Reference: C113; Manufacturer: Murata; Manufacturer Part Number: GRM033R61E104KE14J; Value: 0.1uF; Assy: -; PCB Footprint: C0201
FB1 = INDUCTOR_1: FERRITE BEAD 120 OHM 0402 1LN; Part Reference: FB4; Manufacturer: TDK Corporation; Value: MPZ1005S121CT000; Assy: -; PCB Footprint: FB0402; Manufacturer Part Number: MPZ1005S121CT000
J7 = FH12-22S-0.5SH_1__98_: Connector; Manufacturer_Name: Hirose; Manufacturer_Part_Number: FH12-22S-0.5SH(1)(98); Datasheet Link: https://www.hirose.com/en/product/document?clcode=CL0528-0014-1-98&productname=FH12-22S-0.5SH(1)(98)&series=FH12&documenttype=2DDrawing&lang=en&documentid=0001188303; Height: 2.2mm; Mouser Part Number: 798-FH1222S05SH198; Mouser Price/Stock: https://www.mouser.co.uk/ProductDetail/Hirose-Connector/FH12-22S-0.5SH198?qs=tTj%252BmQ3KZwZO1A%252B5eseZow%3D%3D
R53 = RESISTOR: Part Reference: R18; Populate: <Populate>; PCB Footprint: RLP-101; Value: 4.7K; ASSY: -
R54 = RESISTOR: Part Reference: R19; Populate: <Populate>; PCB Footprint: RLP-101; Value: 4.7K; ASSY: -

## Nets that join several sheets
+12.0V: 01- Power Regulators (9 pins), 02 - Power CSI and Bank Power (R113.2)
GND: 01- Power Regulators (72 pins), 02 - Power CSI and Bank Power (19 pins), 03- Power Decoupling (78 pins), 04 - Camera Interface (37 pins), 05 - Camera Interface 2 (37 pins), 06 - Soft_DPHY (21 pins), 07 - USB Interface (45 pins), 08- Bank2_6_7 (18 pins), 09- I2C, LEDs And Push Button (6 pins), 10 - Configuration And ADC (21 pins), 11- IMU (7 pins), 12 - JETSON_CON (13 pins)
V1P0_LDO: 01- Power Regulators (5 pins), 02 - Power CSI and Bank Power (R133.2 TP_V1P0_LDO.1), 04 - Camera Interface (L7.2 L9.2), 05 - Camera Interface 2 (L6.2 L8.2)
V1P2: 02 - Power CSI and Bank Power (5 pins), 04 - Camera Interface (6 pins), 05 - Camera Interface 2 (6 pins)
V1P8: 01- Power Regulators (10 pins), 02 - Power CSI and Bank Power (10 pins), 04 - Camera Interface (6 pins), 05 - Camera Interface 2 (6 pins), 06 - Soft_DPHY (6 pins), 11- IMU (7 pins)
V1P8_LDO: 01- Power Regulators (6 pins), 02 - Power CSI and Bank Power (R132.2 TP_V1P8_LDO.1), 03- Power Decoupling (FB5.2 FB6.2), 04 - Camera Interface (L5.2), 05 - Camera Interface 2 (L4.2)
V2P8: 02 - Power CSI and Bank Power (5 pins), 04 - Camera Interface (6 pins), 05 - Camera Interface 2 (6 pins)
V3P3: 01- Power Regulators (8 pins), 02 - Power CSI and Bank Power (14 pins), 07 - USB Interface (19 pins), 12 - JETSON_CON (C97.1 FB1.1)
V5P0: 01- Power Regulators (6 pins), 02 - Power CSI and Bank Power (R114.2 TP_V5P0.1)
VCC_CORE_V1P0: 01- Power Regulators (8 pins), 02 - Power CSI and Bank Power (R122.2 TP_VCC_CORE_V1P0.1), 03- Power Decoupling (19 pins)
VCCIO0: 02 - Power CSI and Bank Power (R127.2 TP_VCCIO0.1), 07 - USB Interface (R172.1), 10 - Configuration And ADC (15 pins)
VCCIO1: 02 - Power CSI and Bank Power (R128.2 TP_VCCIO1.1), 07 - USB Interface (7 pins), 09- I2C, LEDs And Push Button (11 pins), 12 - JETSON_CON (R53.2 R54.2)
VCCIO2: 02 - Power CSI and Bank Power (R129.2 TP_VCCIO2.1), 08- Bank2_6_7 (5 pins)
VCCIO3: 02 - Power CSI and Bank Power (R134.2 TP_VCCIO3.1), 06 - Soft_DPHY (5 pins)
VCCIO4: 02 - Power CSI and Bank Power (R135.2 TP_VCCIO4.1), 06 - Soft_DPHY (5 pins)
VCCIO5: 02 - Power CSI and Bank Power (R136.2 TP_VCCIO5.1), 06 - Soft_DPHY (C91.1 C92.1 C93.1 U3.V3)
VCCIO6: 02 - Power CSI and Bank Power (R130.2 TP_VCCIO6.1), 04 - Camera Interface (5 pins), 05 - Camera Interface 2 (5 pins), 08- Bank2_6_7 (9 pins)
VCCIO7: 02 - Power CSI and Bank Power (R131.2 TP_VCCIO7.1), 08- Bank2_6_7 (6 pins)
12MHz: 07 - USB Interface (JP2.2), 09- I2C, LEDs And Push Button (U3.L13)
CAM0_MCLK: 04 - Camera Interface (J3.19), 08- Bank2_6_7 (R34.2)
CAM0_SCL: 04 - Camera Interface (J3.2 R26.2), 08- Bank2_6_7 (U3.N5)
CAM0_SDA: 04 - Camera Interface (J3.1 R25.2), 08- Bank2_6_7 (U3.N4)
CAM1_0_N: 04 - Camera Interface (J4.8 R30.2), 06 - Soft_DPHY (U3.U11)
CAM1_0_P: 04 - Camera Interface (J4.7 R30.1), 06 - Soft_DPHY (U3.V11)
CAM1_1_N: 04 - Camera Interface (J4.11 R31.2), 06 - Soft_DPHY (U3.V12)
CAM1_1_P: 04 - Camera Interface (J4.10 R31.1), 06 - Soft_DPHY (U3.W13)
CAM1_CLK_N: 04 - Camera Interface (J4.5 R38.2), 06 - Soft_DPHY (U3.Y11)
CAM1_CLK_P: 04 - Camera Interface (J4.4 R38.1), 06 - Soft_DPHY (U3.W11)
CAM1_MCLK: 04 - Camera Interface (J4.19), 08- Bank2_6_7 (R35.2)
CAM1_SCL: 04 - Camera Interface (J4.2 R33.2), 08- Bank2_6_7 (U3.P6)
CAM1_SDA: 04 - Camera Interface (J4.1 R32.2), 08- Bank2_6_7 (U3.P5)
CAM2_MCLK: 05 - Camera Interface 2 (J5.19), 08- Bank2_6_7 (R47.2)
CAM2_SCL: 05 - Camera Interface 2 (J5.2 R44.2), 08- Bank2_6_7 (U3.P2)
CAM2_SDA: 05 - Camera Interface 2 (J5.1 R43.2), 08- Bank2_6_7 (U3.P1)
CAM3_0_N: 05 - Camera Interface 2 (J6.8 R41.2), 06 - Soft_DPHY (U3.Y16)
CAM3_0_P: 05 - Camera Interface 2 (J6.7 R41.1), 06 - Soft_DPHY (U3.Y15)
CAM3_1_N: 05 - Camera Interface 2 (J6.11 R42.2), 06 - Soft_DPHY (U3.V16)
CAM3_1_P: 05 - Camera Interface 2 (J6.10 R42.1), 06 - Soft_DPHY (U3.U15)
CAM3_CLK_N: 05 - Camera Interface 2 (J6.5 R52.2), 06 - Soft_DPHY (U3.T14)
CAM3_CLK_P: 05 - Camera Interface 2 (J6.4 R52.1), 06 - Soft_DPHY (U3.T13)
CAM3_MCLK: 05 - Camera Interface 2 (J6.19), 08- Bank2_6_7 (R48.2)
CAM3_SCL: 05 - Camera Interface 2 (J6.2 R46.2), 08- Bank2_6_7 (U3.N7)
CAM3_SDA: 05 - Camera Interface 2 (J6.1 R45.2), 08- Bank2_6_7 (U3.N6)
CAM_RESET: 04 - Camera Interface (J3.21 J4.21), 05 - Camera Interface 2 (J5.21 J6.21), 06 - Soft_DPHY (U3.W18)
CSI_TX_CLK_N: 06 - Soft_DPHY (U3.U6), 12 - JETSON_CON (J7.8)
CSI_TX_CLK_P: 06 - Soft_DPHY (U3.T6), 12 - JETSON_CON (J7.9)
CSI_TX_D0_N: 06 - Soft_DPHY (U3.T7), 12 - JETSON_CON (J7.2)
CSI_TX_D0_P: 06 - Soft_DPHY (U3.R7), 12 - JETSON_CON (J7.3)
CSI_TX_D1_N: 06 - Soft_DPHY (U3.U7), 12 - JETSON_CON (J7.5)
CSI_TX_D1_P: 06 - Soft_DPHY (U3.V6), 12 - JETSON_CON (J7.6)
FSIN0: 04 - Camera Interface (J3.16), 06 - Soft_DPHY (R58.2)
FSIN1: 04 - Camera Interface (J4.16), 06 - Soft_DPHY (R59.2)
FSIN2: 05 - Camera Interface 2 (J5.16), 06 - Soft_DPHY (R60.2)
FSIN3: 05 - Camera Interface 2 (J6.16), 06 - Soft_DPHY (R61.2)
FSIN_IMU: 06 - Soft_DPHY (R62.2), 11- IMU (IC1.9)
I2C_CON_SCL: 09- I2C, LEDs And Push Button (U3.G15), 12 - JETSON_CON (J7.14 R53.1)
I2C_CON_SDA: 09- I2C, LEDs And Push Button (U3.G14), 12 - JETSON_CON (J7.13 R54.1)
IMU_CS: 06 - Soft_DPHY (U3.R8), 11- IMU (IC1.12)
IMU_INT1: 06 - Soft_DPHY (U3.Y7), 11- IMU (IC1.4 R57.2)
IMU_MISO: 06 - Soft_DPHY (U3.T8), 11- IMU (IC1.1)
IMU_MOSI: 06 - Soft_DPHY (U3.P7), 11- IMU (IC1.14)
IMU_SCLK: 06 - Soft_DPHY (U3.P8), 11- IMU (IC1.13)
PROGRAMN: 07 - USB Interface (R172.2 R173.2), 10 - Configuration And ADC (J20.1 R77.1 U3.E11)
RXD_UART: 07 - USB Interface (R17.2), 09- I2C, LEDs And Push Button (U3.F18)
SCL: 07 - USB Interface (R20.2 TP1.1), 09- I2C, LEDs And Push Button (R74.1)
SDA: 07 - USB Interface (R21.2 R22.2 TP2.1), 09- I2C, LEDs And Push Button (R73.1)
TCK: 07 - USB Interface (J1.6 R4.1 R5.2), 09- I2C, LEDs And Push Button (U3.G18)
TDI: 07 - USB Interface (J1.5 R2.2 R6.2), 09- I2C, LEDs And Push Button (U3.F17)
TDO: 07 - USB Interface (J1.3 R3.2 R7.2), 09- I2C, LEDs And Push Button (U3.F19)
TMS: 07 - USB Interface (J1.2 R1.2 R8.2), 09- I2C, LEDs And Push Button (U3.F15)
TXD_UART: 07 - USB Interface (R15.2), 09- I2C, LEDs And Push Button (U3.F16)